# Altium project tecctrl.PrjPCB
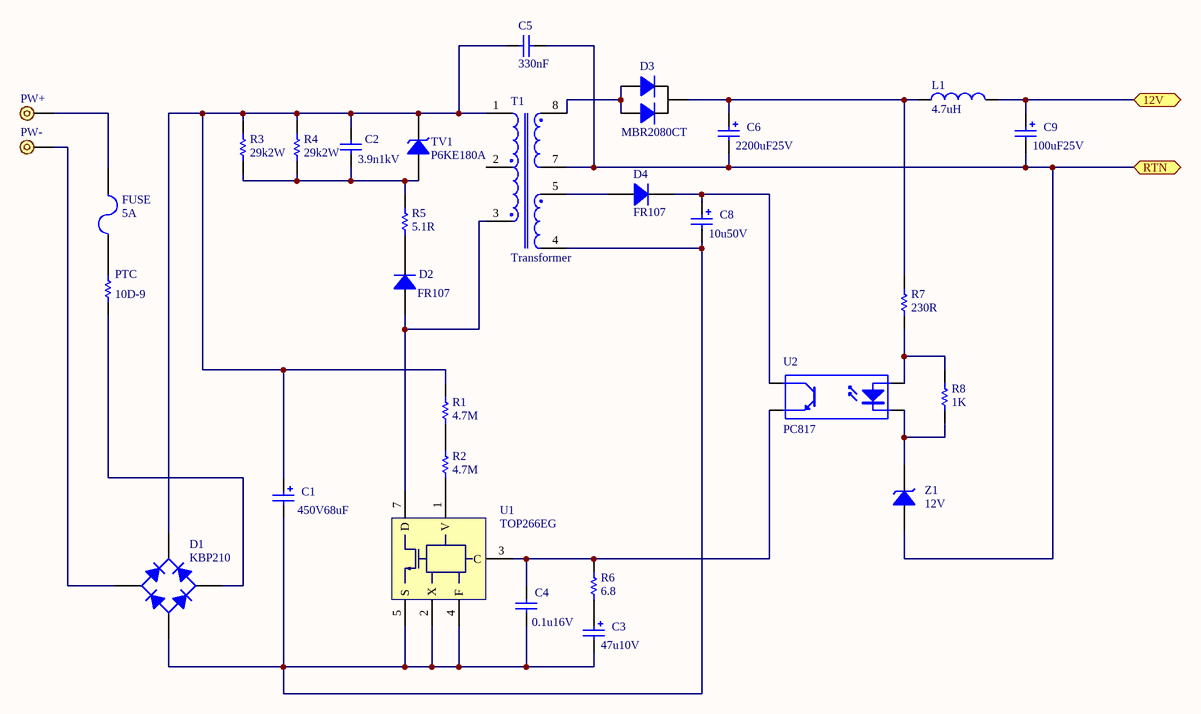
[diagram p0: power.SchDoc]
2 sheets, 56 parts. Net scope: flat (ports and power ports of the same name join across sheets).
Board file: tecctrl.PcbDoc
Sheets:
  power.SchDoc
  control.SchDoc

## Sheet power.SchDoc
size A4

### Parts
C1  450V68uF  [CAP_18x30]
C2  3.9n1kV  [CAP7]
C3  47u10V  [CAP3]
C4  0.1u16V  [CAP6]
C5  330nF  [CAP_MKP]
C6  2200uF25V  [CAP_18x30]
C8  10u50V  [CAP3]
C9  100uF25V  [CAP3]
D1  KBP210  [KBP310]
D2  FR107  [DIO1]
D3  MBR2080CT  [TO247_TO220_SINK]
D4  FR107  [DIO1]
FUSE  5A  [FUSE5X20]
L1  4.7uH  [CHOKE]
PTC  10D-9  [PTC]
PW+  (no value)  [PAD1]
PW-  (no value)  [PAD1]
R1  4.7M  [RES0.25W]
R2  4.7M  [RES0.25W]
R3  29k2W  [RES2W_H]
R4  29k2W  [RES2W_H]
R5  5.1R  [RES0.25W]
R6  6.8  [RES0.25W]
R7  230R  [RES0.25W]
R8  1K  [RES0.25W]
T1  Transformer  [EER28]
TV1  P6KE180A  [DIO1]
U1  TOP266EG  [eSIP_SINK]
U2  PC817  [DIP-4]
Z1  12V  [DIO2]

### Ports
12V, RTN

### Nets
GND: C5.2 C6.2 C9.2 T1.7 Z1.1(A) ; port RTN
12V: C9.1 L1.2 ; port 12V
NetC1_1: C1.1 C2.1 C5.1 D1.1(K) R1.2 R3.2 R4.2 T1.1 TV1.2(K)
NetC1_2: C1.2 C3.2 C4.2 C8.2 D1.4(A) T1.4 U1.2(X) U1.4(F) U1.5(S)
NetC2_2: C2.2 R3.1 R4.1 R5.2 TV1.1(A)
NetC3_1: C3.1 R6.1
NetC4_1: C4.1 R6.2 U1.3(C) U2.3(E)
NetC6_1: C6.1 D3.2(K) L1.1 R7.2
NetC8_1: C8.1 D4.2(K) U2.4(C)
NetD1_2: D1.2(C) PTC.2
NetD1_3: D1.3(C) PW-.1
NetD2_1: D2.1(A) T1.3 U1.7(D)
NetD2_2: D2.2(K) R5.1
NetD3_1: D3.1(A) D3.3(A) T1.8
NetD4_1: D4.1(A) T1.5
NetFUSE_1: FUSE.1 PW+.1
NetFUSE_2: FUSE.2 PTC.1
NetR1_1: R1.1 R2.2
NetR2_1: R2.1 U1.1(V)
NetR7_1: R7.1 R8.2 U2.1(A)
NetR8_1: R8.1 U2.2(K) Z1.2(K)

Not connected (* = marked no-connect by the designer): T1 2

### Library data of the parts
C1 C3 C6 C8 C9 = Cap Pol2: Polarized Capacitor (Axial); Published: 8-Jun-2000; LatestRevisionDate: 17-Jul-2002; LatestRevisionNote: Re-released for DXP Platform.; Publisher: Altium Limited
C2 C4 C5 = Cap: Capacitor; Published: 8-Jun-2000; LatestRevisionDate: 17-Jul-2002; LatestRevisionNote: Re-released for DXP Platform.; Publisher: Altium Limited
D1 = KBP310: Single Phase Rectifier Bridge; Published: 8-Jun-2000; LatestRevisionDate: 17-Jul-2002; LatestRevisionNote: Re-released for DXP Platform.; DatasheetDocument: E2753A; PackageReference: D-44; Publisher: Altium Limited; ComponentLink1Description: Manufacturer Link; ComponentLink1URL: http://www.irf.com/
D2 D4 = Diode: 1 Amp Fast Recovery Rectifier; Published: 8-Jun-2000; LatestRevisionDate: 17-Jul-2002; LatestRevisionNote: Re-released for DXP Platform.; PackageReference: DO-41; Publisher: Altium Limited; Code_JEDEC: DO-204-AL; DatasheetDocument: 1999; PackageDocument: Aug-1999; ComponentLink1Description: Manufacturer Link; ComponentLink1URL: http://www.fairchildsemi.com/
D3 = Diode2: Dual Diode TO-247; Published: 8-Jun-2000; LatestRevisionDate: 17-Jul-2002; LatestRevisionNote: Re-released for DXP Platform.; DatasheetDocument: 1999; PackageDocument: Aug-1999; PackageReference: DO-41; Publisher: Altium Limited; ComponentLink1Description: Manufacturer Link; ComponentLink1URL: http://www.fairchildsemi.com/; Code_JEDEC: DO-204-AL
FUSE = Fuse 2: Fuse; Published: 8-Jun-2000; LatestRevisionDate: 17-Jul-2002; LatestRevisionNote: Re-released for DXP Platform.; Publisher: Altium Limited
L1 = Inductor: Code_IEC: 1005; Published: 8-Jun-2000; LatestRevisionDate: 17-Jul-2002; LatestRevisionNote: Re-released for DXP Platform.; PackageReference: 0402-A; Publisher: Altium Limited; Code_JEITA: 0402
PTC R1-R8 = Res1: Resistor; Published: 8-Jun-2000; LatestRevisionDate: 17-Jul-2002; LatestRevisionNote: Re-released for DXP Platform.; Publisher: Altium Limited
PW+ PW- = Header1: Header, 1-Pin; LatestRevisionDate: 17-Jul-2002; LatestRevisionNote: Re-released for DXP Platform.; Publisher: Altium Limited
T1 = EER28: Published: 24-Mar-1999; LatestRevisionDate: 17-Jul-2002; LatestRevisionNote: Re-released for DXP Platform.; Publisher: Altium Limited
TV1 Z1 = D Zener: Zener Diode; Published: 8-Jun-2000; LatestRevisionDate: 17-Jul-2002; LatestRevisionNote: Re-released for DXP Platform.; Publisher: Altium Limited
U1 = TOP26xEG: PI TopSwitch II
U2 = Optoisolator1: 4-Pin Phototransistor Optocoupler; Published: 24-Mar-1999; LatestRevisionDate: 4-Mar-2005; LatestRevisionNote: Sch pins 3 & 4 Swapped.; DatasheetDocument: Nov-2003; PackageReference: DIP-4; Publisher: Altium Limited

## Sheet control.SchDoc
size A4
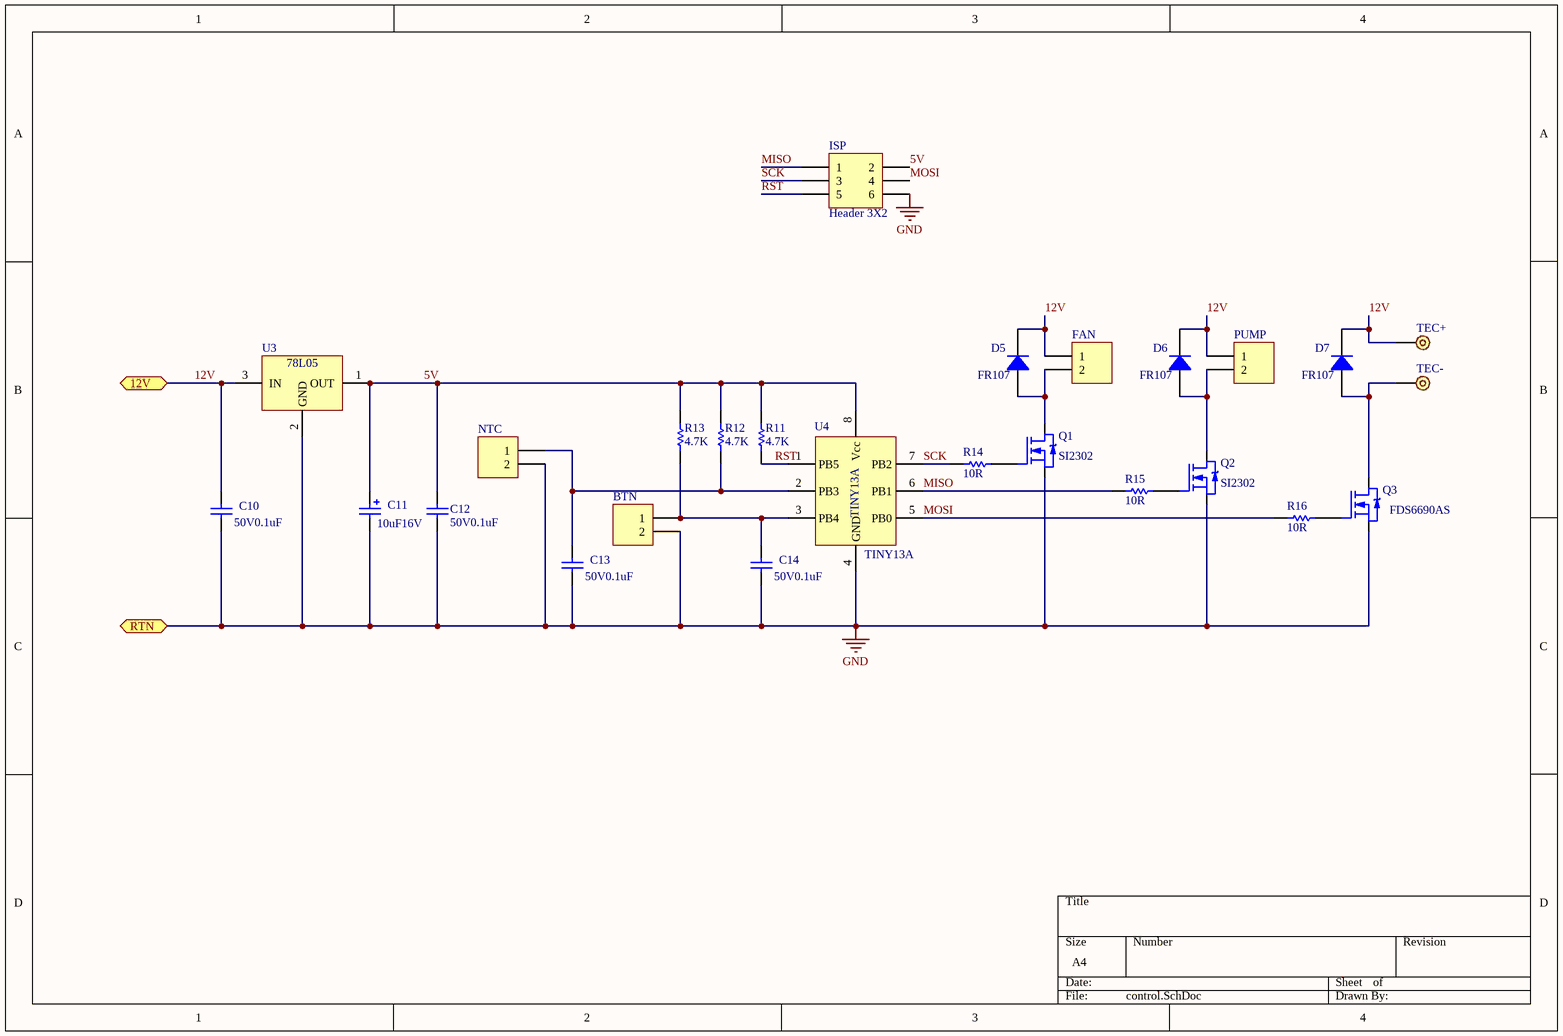
[diagram p1: control.SchDoc]

### Parts
BTN  (no value)  [JST2]
C10  50V0.1uF  [CAP0805]
C11  10uF16V  [CAP1206]
C12  50V0.1uF  [CAP0805]
C13  50V0.1uF  [CAP0805]
C14  50V0.1uF  [CAP0805]
D5  FR107  [DO214AC]
D6  FR107  [DO214AC]
D7  FR107  [DO214AC]
FAN  (no value)  [JST2]
ISP  Header 3X2  [HDR2X3]
NTC  (no value)  [JST2]
PUMP  (no value)  [JST2]
Q1  SI2302  [SOT23_NMOS]
Q2  SI2302  [SOT23_NMOS]
Q3  FDS6690AS  [SO8-NMOS]
R11  4.7K  [RES0805]
R12  4.7K  [RES0805]
R13  4.7K  [RES0805]
R14  10R  [RES0805]
R15  10R  [RES0805]
R16  10R  [RES0805]
TEC+  (no value)  [PAD1]
TEC-  (no value)  [PAD1]
U3  (no value)  [SOT89_VREG]
U4  TINY13A  [SO8]

### Ports
12V, RTN

### Nets
GND: BTN.2 C10.2 C11.2 C12.2 C13.2 C14.2 ISP.6 NTC.2 Q1.S Q2.S Q3.S U3.2(GND) U4.4(GND) ; port RTN
5V: C11.1 C12.1 ISP.2 R11.2 R12.2 R13.2 U3.1(OUT) U4.8(Vcc)
12V: C10.1 D5.2(K) D6.2(K) D7.2(K) FAN.1 PUMP.1 TEC+.1 U3.3(IN) ; port 12V
MISO: ISP.1 R15.2 U4.6(PB1)
MOSI: ISP.4 R16.2 U4.5(PB0)
RST: ISP.5 R11.1 U4.1(PB5)
SCK: ISP.3 R14.2 U4.7(PB2)
NetBTN_1: BTN.1 C14.1 R13.1 U4.3(PB4)
NetC13_1: C13.1 NTC.1 R12.1 U4.2(PB3)
NetD5_1: D5.1(A) FAN.2 Q1.D
NetD6_1: D6.1(A) PUMP.2 Q2.D
NetD7_1: D7.1(A) Q3.D TEC-.1
NetQ1_G: Q1.G R14.1
NetQ2_G: Q2.G R15.1
NetQ3_G: Q3.G R16.1

### Library data of the parts
BTN FAN NTC PUMP = Header 2: Header, 2-Pin; LatestRevisionDate: 17-Jul-2002; LatestRevisionNote: Re-released for DXP Platform.; Publisher: Altium Limited
C10 C12-C14 = Cap: Capacitor; Published: 8-Jun-2000; LatestRevisionDate: 17-Jul-2002; LatestRevisionNote: Re-released for DXP Platform.; Publisher: Altium Limited
C11 = Cap Pol2: Polarized Capacitor (Axial); Published: 8-Jun-2000; LatestRevisionDate: 17-Jul-2002; LatestRevisionNote: Re-released for DXP Platform.; Publisher: Altium Limited
D5-D7 = Diode: 1 Amp Fast Recovery Rectifier; Published: 8-Jun-2000; LatestRevisionDate: 17-Jul-2002; LatestRevisionNote: Re-released for DXP Platform.; PackageReference: DO-41; Publisher: Altium Limited; Code_JEDEC: DO-204-AL; DatasheetDocument: 1999; PackageDocument: Aug-1999; ComponentLink1Description: Manufacturer Link; ComponentLink1URL: http://www.fairchildsemi.com/
ISP = Header 3X2: Header, 3-Pin, Dual row; LatestRevisionDate: 17-Jul-2002; LatestRevisionNote: Re-released for DXP Platform.; Publisher: Altium Limited
Q1-Q3 = NMOS: DUAL MOSFET N; Published: 8-Jun-2000; LatestRevisionDate: 17-Jul-2002; LatestRevisionNote: Re-released for DXP Platform.; PackageVersion: 1995/1996; PackageReference: E3; Publisher: Altium Limited; PackageDescription: TO, Flat Index; 3 In-Line, Axial Leads; Body Dia. 4.6mm; Lead Dia. 0.5 mm (max)
R11-R16 = Res1: Resistor; Published: 8-Jun-2000; LatestRevisionDate: 17-Jul-2002; LatestRevisionNote: Re-released for DXP Platform.; Publisher: Altium Limited
TEC+ TEC- = Header1: Header, 1-Pin; LatestRevisionDate: 17-Jul-2002; LatestRevisionNote: Re-released for DXP Platform.; Publisher: Altium Limited
U3 = 78L05: Positive Voltage Regulator; Published: 24-Aug-2001; LatestRevisionDate: 6-Jun-2005; LatestRevisionNote: PCB pads lengthened.; DatasheetDocument: Apr-1994; PackageDocument: Jun-2004; PackageReference: TO-252; Publisher: Altium Limited; ComponentLink1Description: Manufacturer Link; ComponentLink1URL: http://www.st.com/
U4 = TINY13A: AVR MCU

## Nets that join several sheets
GND: power (5 pins), control (13 pins)
12V: power (C9.1 L1.2), control (8 pins)